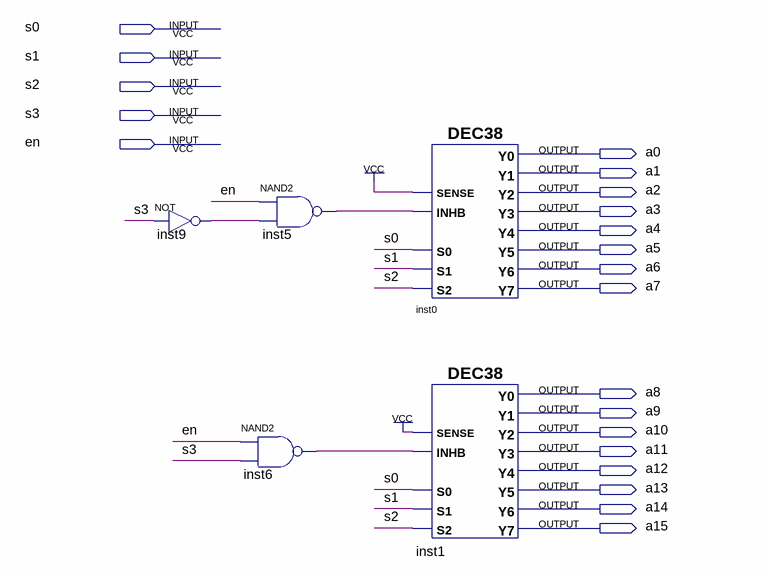
[diagram p0: schematic sheet]
// Quartus schematic dec416.bdf as structural Verilog: 5 symbols, 21 pins
module dec416 (
  input  s0,
  input  s1,
  input  s2,
  input  s3,
  input  en,
  output a0,
  output a1,
  output a2,
  output a3,
  output a4,
  output a5,
  output a6,
  output a7,
  output a8,
  output a9,
  output a10,
  output a11,
  output a12,
  output a13,
  output a14,
  output a15
);

  wire inst5_out, inst6_out, inst9_out;

  not inst9 (inst9_out, s3);
  nand inst5 (inst5_out, en, inst9_out);
  nand inst6 (inst6_out, en, s3);
  DEC38 inst0 (
    .S2(s2), .S1(s1), .INHB(inst5_out), .S0(s0), .SENSE(1'b1), .Y7(a7), .Y6(a6), .Y5(a5), .Y3(a3), .Y4(a4),
    .Y0(a0), .Y1(a1), .Y2(a2));
  DEC38 inst1 (
    .S2(s2), .S1(s1), .INHB(inst6_out), .S0(s0), .SENSE(1'b1), .Y7(a15), .Y6(a14), .Y5(a13), .Y3(a11),
    .Y4(a12), .Y0(a8), .Y1(a9), .Y2(a10));
endmodule
